# Altium project 025619-TurtleBot4 UI board.PrjPcb (part 2 of 3)

## Sheet USB Downstream Type C Port 3.SchDoc: DO NOT FILL THIS IN
size Tabloid; Date: DO NOT FILL THIS IN; ApprovedBy: DO NOT FILL THIS IN; CheckedBy: DO NOT FILL THIS IN; Author: DO NOT FILL THIS IN; CompanyName: DO NOT FILL THIS IN; DrawnBy: DO NOT FILL THIS IN; Engineer: DO NOT FILL THIS IN; Organization: DO NOT FILL THIS IN; Address1: DO NOT FILL THIS IN; Address2: DO NOT FILL THIS IN; Address3: DO NOT FILL THIS IN; Address4: DO NOT FILL THIS IN; DocumentNumber: DO NOT FILL THIS IN; Revision: DO NOT FILL THIS IN; SheetNumber: 7; SheetTotal: 9; PageSetup: Record=PageOptions|CenterHorizontal=True|CenterVertical=True|PrintScale=1.00|XCorrection=1.00|YCorrection=1.00|PrintKind=1|BorderSize=5000000|LeftOffset=0|BottomOffset=0|Orientation=2|PaperLength=1000|PaperWidth=1000|Scale=100|PaperSource=7|PrintQuality=-4|MediaType=1|DitherType=10|PaperKind=Ledger|PrintScaleMode=1; cpr-ItemNumber: 025619; cpr-ItemName1: TurtleBot4 UI board; cpr-ItemName2: Rev 2; cpr-Revision: 2; cpr-SheetNumber: 7; cpr-SheetTotal: 9; cpr-Draft: AG; cpr-DraftDate: 19/04/2022; Time: DO NOT FILL THIS IN; ImagePath: DO NOT FILL THIS IN; Application_BuildNumber: DO NOT FILL THIS IN
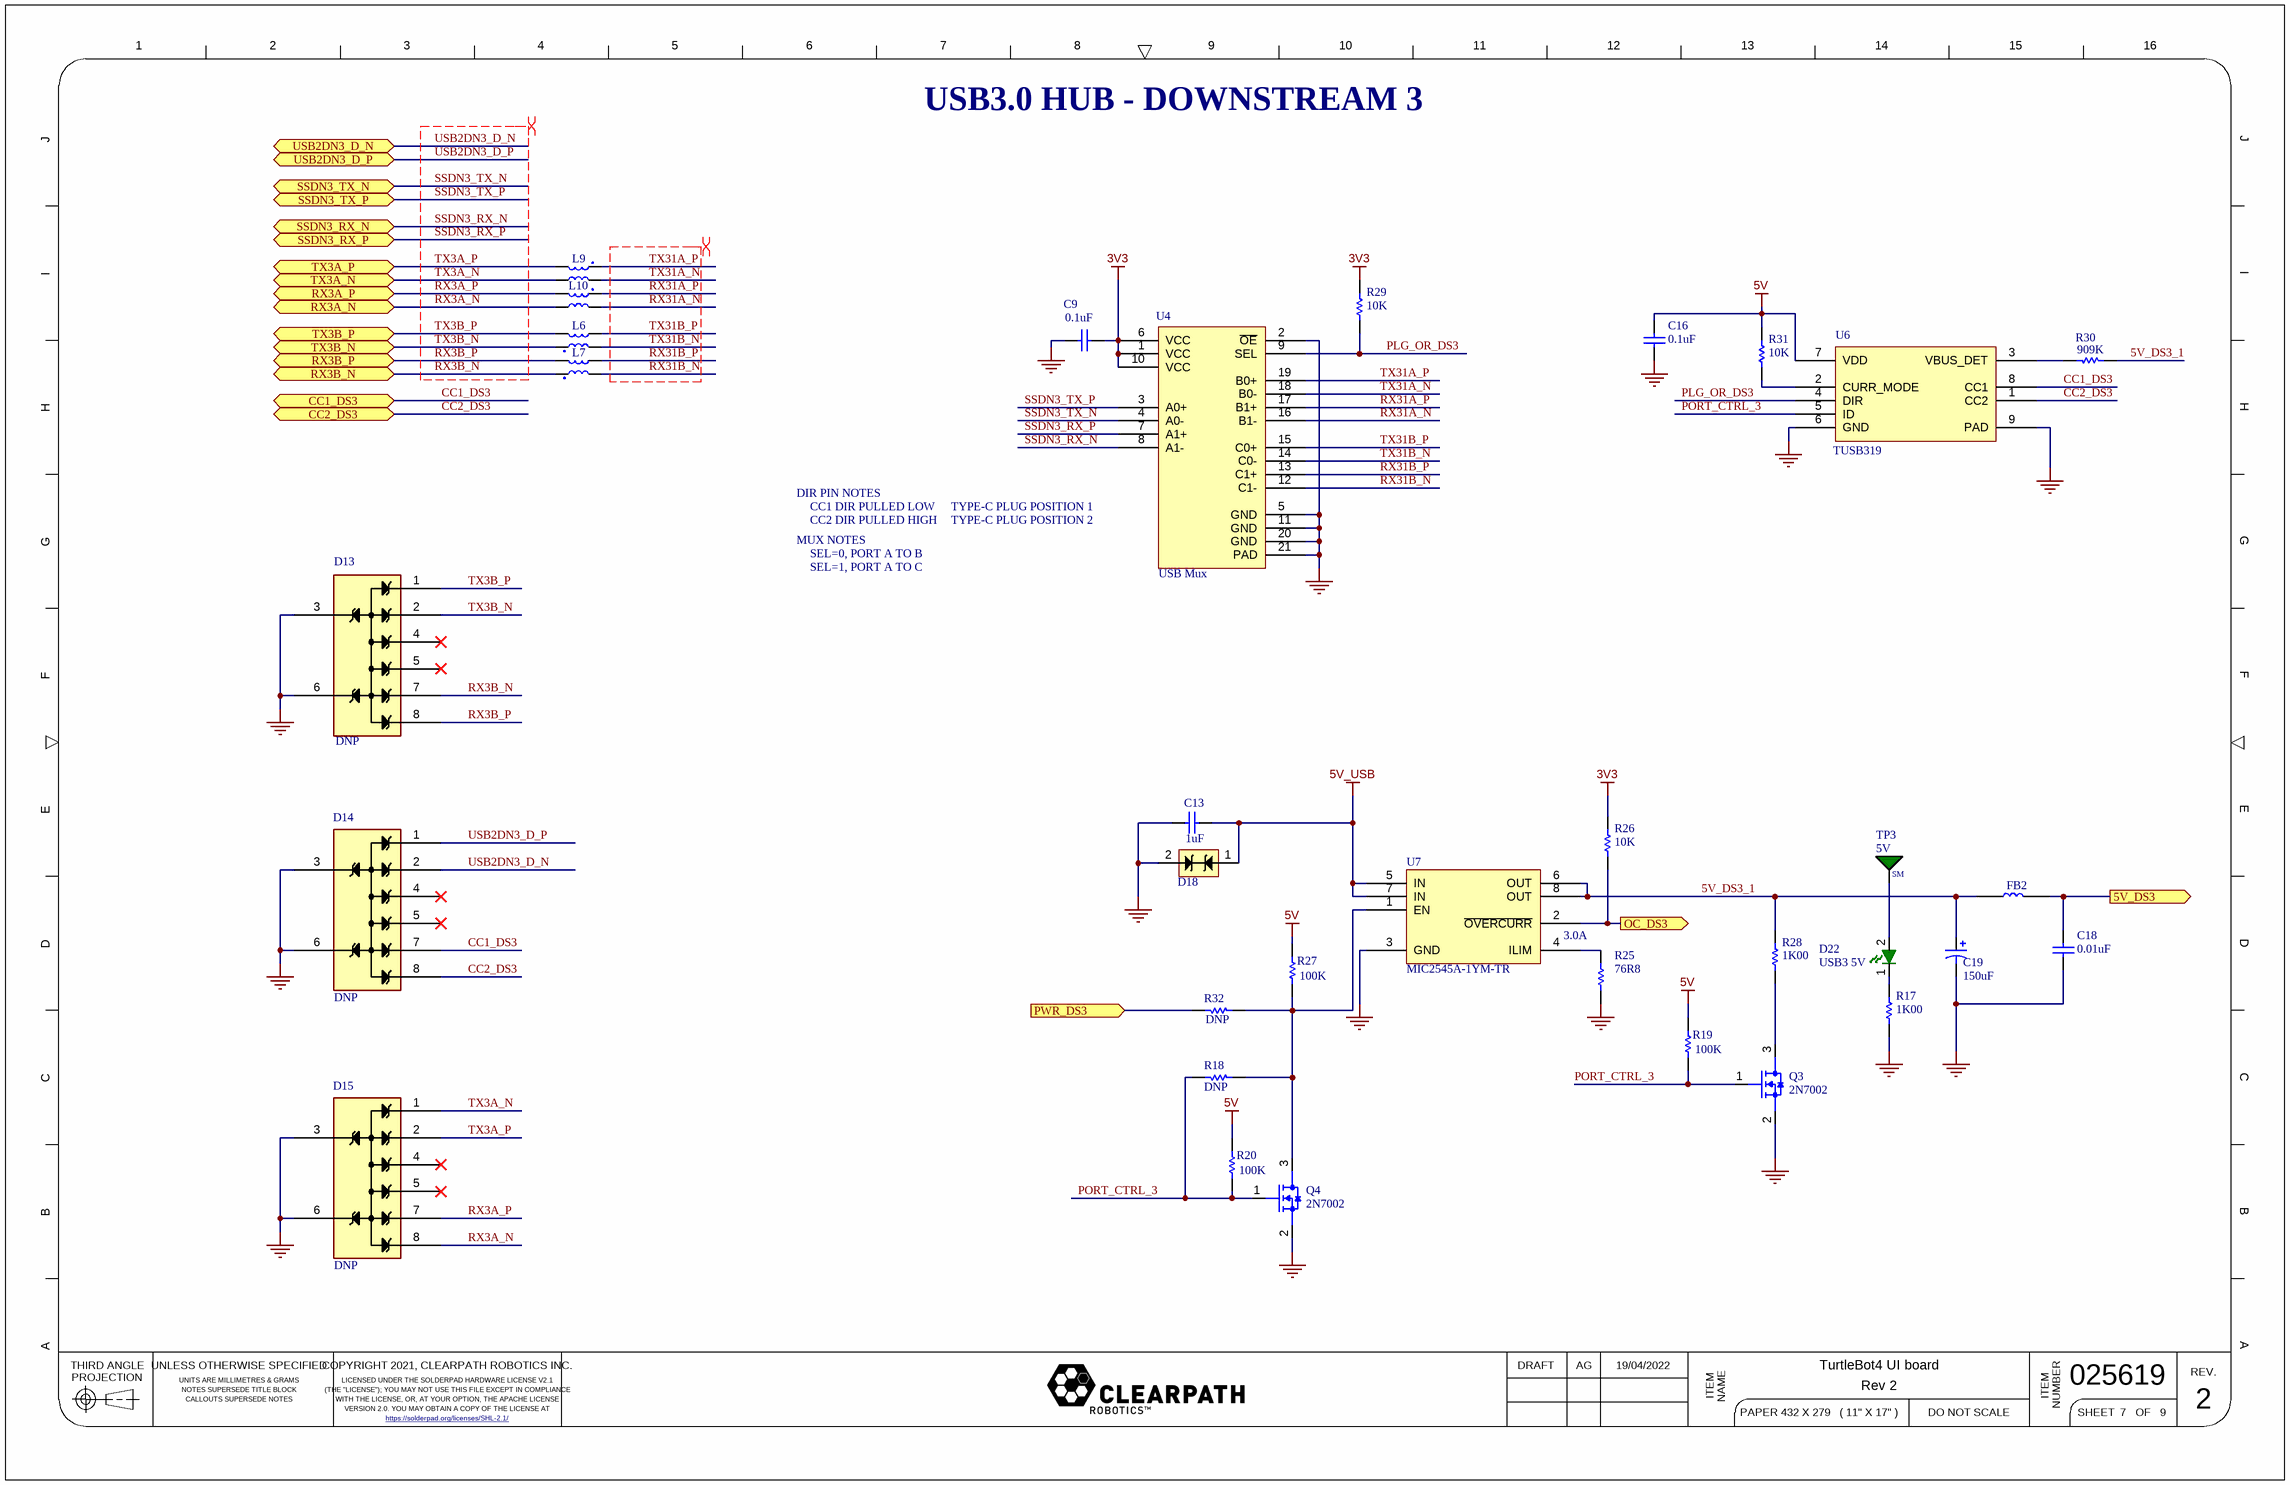
[diagram p4: USB Downstream Type C Port 3.SchDoc]

### Parts
C9  value 0.1uF  [C0805]  (hidden comment: Capacitor _SMT)
C13  value 1uF  [C0805]  (hidden comment: Capacitor _SMT)
C16  value 0.1uF  [C0805]  (hidden comment: Capacitor _SMT)
C18  value 0.01uF  [C0805]  (hidden comment: Capacitor _SMT)
C19  value 150uF  [CAPMP7.6X4.3_3.1N_KEM-M]  (hidden comment: Cap Tant)
D13  DNP  [ESD7016]
D14  DNP  [ESD7016]
D15  DNP  [ESD7016]
D18  TVS DIODE BIDIR 15V SMC  [DO-214AA]  (value not drawn)
D22  USB3 5V  [LED_0805_GRN]
FB2  742792602  [R0603]  (value not drawn)
L6  CMC 100MA 2LN 90 OHM SMD2  [cmc_90_ohms]  (value not drawn)
L7  CMC 100MA 2LN 90 OHM SMD2  [cmc_90_ohms]  (value not drawn)
L9  CMC 100MA 2LN 90 OHM SMD2  [cmc_90_ohms]  (value not drawn)
L10  CMC 100MA 2LN 90 OHM SMD2  [cmc_90_ohms]  (value not drawn)
Q3  Mfg PN: 2N7002  [SOT-23-3]  (hidden comment: NFET)
Q4  Mfg PN: 2N7002  [SOT-23-3]  (hidden comment: NFET)
R17  value 1K00  [R0805]  (hidden comment: Resistor_SMT)
R18  value DNP  [R0805]  (hidden comment: Resistor_SMT)
R19  value 100K  [R0805]  (hidden comment: Resistor_SMT)
R20  value 100K  [R0805]  (hidden comment: Resistor_SMT)
R25  3.0A  value 76R8  [R0805]
R26  value 10K  [R0805]  (hidden comment: Resistor_SMT)
R27  value 100K  [R0805]  (hidden comment: Resistor_SMT)
R28  value 1K00  [R0805]  (hidden comment: Resistor_SMT)
R29  value 10K  [R0805]  (hidden comment: Resistor_SMT)
R30  value 909K  [R0805]  (hidden comment: Resistor_SMT)
R31  value 10K  [R0805]  (hidden comment: Resistor_SMT)
R32  value DNP  [R0805]  (hidden comment: Resistor_SMT)
TP3  5V  [TP_28SM]
U4  USB Mux  [TQFN20]
U6  TUSB319  [WSON8]
U7  Mfg PN: MIC2545A-1YM-TR  [SOIC-8-150]  (hidden comment: MIC2545_USB_SWITCH)

### Ports
5V_DS3 (out), CC1_DS3 (bidir), CC2_DS3 (bidir), OC_DS3 (out), PWR_DS3 (in), RX3A_N (bidir), RX3A_P (bidir), RX3B_N (bidir), RX3B_P (bidir), SSDN3_RX_N (bidir), SSDN3_RX_P (bidir), SSDN3_TX_N (bidir), SSDN3_TX_P (bidir), TX3A_N (bidir), TX3A_P (bidir), TX3B_N (bidir), TX3B_P (bidir), USB2DN3_D_N (bidir), USB2DN3_D_P (bidir)

### Nets
3V3: C9.1 R26.1 R29.1 U4.1(VCC) U4.6(VCC) U4.10(VCC)
5V: C16.1 R19.2 R20.2 R27.2 R31.1 U6.7(VDD)
5V_USB: C13.2 D18.1 U7.5(IN) U7.7(IN)
GND: C9.2 C13.1 C16.2 C18.2 C19.2 D13.3 D13.6 D14.3 D14.6 D15.3 D15.6 D18.2 Q3.2(D1) Q4.2(D1) R17.2 R25.1 U4.2(~{OE}) U4.5(GND) U4.11(GND) U4.20(GND) U4.21(PAD) U6.6(GND) U6.9(PAD) U7.3(GND)
5V_DS3: C18.1 FB2.2 ; port 5V_DS3
5V_DS3_1: C19.1 FB2.1 R28.1 R30.2 U7.6(OUT) U7.8(OUT)
CC1_DS3: D14.7 U6.8(CC1) ; port CC1_DS3
CC2_DS3: D14.8 U6.1(CC2) ; port CC2_DS3
OC_DS3: R26.2 U7.2(~{OVERCURR}) ; port OC_DS3
PLG_OR_DS3: R29.2 U4.9(SEL) U6.4(DIR)
PORT_CTRL_3: Q3.1(G1) Q4.1(G1) R18.1 R19.1 R20.1 U6.5(ID)
PWR_DS3: R32.1 ; port PWR_DS3
RX3A_N: D15.8 L10.3 ; port RX3A_N
RX3A_P: D15.7 L10.4 ; port RX3A_P
RX3B_N: D13.7 L7.1 ; port RX3B_N
RX3B_P: D13.8 L7.2 ; port RX3B_P
RX31A_N: L10.2 U4.16(B1-)
RX31A_P: L10.1 U4.17(B1+)
RX31B_N: L7.4 U4.12(C1-)
RX31B_P: L7.3 U4.13(C1+)
SSDN3_RX_N: U4.8(A1-) ; port SSDN3_RX_N
SSDN3_RX_P: U4.7(A1+) ; port SSDN3_RX_P
SSDN3_TX_N: U4.4(A0-) ; port SSDN3_TX_N
SSDN3_TX_P: U4.3(A0+) ; port SSDN3_TX_P
TX3A_N: D15.1 L9.3 ; port TX3A_N
TX3A_P: D15.2 L9.4 ; port TX3A_P
TX3B_N: D13.2 L6.1 ; port TX3B_N
TX3B_P: D13.1 L6.2 ; port TX3B_P
TX31A_N: L9.2 U4.18(B0-)
TX31A_P: L9.1 U4.19(B0+)
TX31B_N: L6.4 U4.14(C0-)
TX31B_P: L6.3 U4.15(C0+)
USB2DN3_D_N: D14.2 ; port USB2DN3_D_N
USB2DN3_D_P: D14.1 ; port USB2DN3_D_P
NetD22_1: D22.1(RK) R17.1
NetD22_2: D22.2(RA) TP3.1
NetQ3_3: Q3.3(S1) R28.2
NetQ4_3: Q4.3(S1) R18.2 R27.1 R32.2 U7.1(EN)
NetR25_2: R25.2 U7.4(ILIM)
NetR30_1: R30.1 U6.3(VBUS_DET)
NetR31_2: R31.2 U6.2(CURR_MODE)

Not connected (* = marked no-connect by the designer): D13 4* 5*; D14 4* 5*; D15 4* 5*

### Layout directives
differential pair; net class USB3; differential pair class DIFF90; rule Matched Net Lengths [Tolerance = 15mil]: RX3A_N, RX3A_P, RX3B_N, RX3B_P, RX31A_N, RX31A_P, RX31B_N, RX31B_P, SSDN3_RX_N, SSDN3_RX_P, SSDN3_TX_N, SSDN3_TX_P, TX3A_N, TX3A_P, TX3B_N, TX3B_P, TX31A_N, TX31A_P, TX31B_N, TX31B_P, USB2DN3_D_N, USB2DN3_D_P

### Notes on the sheet
- USB3.0 HUB - DOWNSTREAM 3
- DIR PIN NOTES
- MUX NOTES
- CC1 DIR PULLED LOW
- CC2 DIR PULLED HIGH
- SEL=0, PORT A TO B
- SEL=1, PORT A TO C
- TYPE-C PLUG POSITION 1
- TYPE-C PLUG POSITION 2
- 1
- 2
- 3
- 4
- 5
- 6
- 7
- 8
- 9
- 10
- 11
- 12
- 13
- 14
- 15
- 16
- J
- I
- H
- G
- F
- E
- D
- C
- B
- A
- THIRD ANGLE
- PROJECTION
- UNLESS OTHERWISE SPECIFIED
- COPYRIGHT 2021, CLEARPATH ROBOTICS INC.
- DRAFT
- REV.
- UNITS ARE MILLIMETRES & GRAMS
- NOTES SUPERSEDE TITLE BLOCK
- CALLOUTS SUPERSEDE NOTES
- LICENSED UNDER THE SOLDERPAD HARDWARE LICENSE V2.1
- (THE "LICENSE"); YOU MAY NOT USE THIS FILE EXCEPT IN COMPLIANCE
- WITH THE LICENSE, OR, AT YOUR OPTION, THE APACHE LICENSE
- VERSION 2.0. YOU MAY OBTAIN A COPY OF THE LICENSE AT
- https://solderpad.org/licenses/SHL-2.1/ <https://solderpad.https://solderpad.org/licenses/SHL-2.1/org/licenses/SHL-2.1/>
- ITEM
- NAME
- PAPER 432 X 279   ( 11" X 17" )
- DO NOT SCALE
- NUMBER
- SHEET
- OF
- (in symbol TP_28SM) SM

### Library data of the parts
C9 C16 = Capacitor _SMT: as C1 on sheet Top Level; DNP: *; Package: 0805
C13 = Capacitor _SMT: as C7 on sheet USB Downstream Type C Port 4; DNP: *; Package: 0805
C18 = Capacitor _SMT: as C8 on sheet USB Downstream Type C Port 4; DNP: *; Package: 0603; Supplier 1: Digi-Key; Supplier Part Number 1: 1276-CL10B103KB8WPNDCT-ND
C19 = Cap Pol1: as C4 on sheet USB Downstream Type C Port 4; Voltage: 16V; Tolerance: 10%; Package: 2917; Supplier 1: Digi-Key; Supplier Part Number 1: 718-1746-1-ND
D13-D15 = ESD7016: as D16 on sheet USB Distribution; Vendor 2 PN: *; Vendor 2: *
D18 = TVS DIODE BIDIR 15V SMC: as D20 on sheet User Interface; Package: DO214AC; Supplier 1: Digi-Key; Supplier Part Number 1: 18-SMA6J5.0CACT-ND
D22 = GREEN_LED: as D12 on sheet USB Downstream Type C Port 4; Package: 0805
FB2 = 742792602: as FB1 on sheet USB Downstream Type C Port 4; Supplier 1: Digi-Key; Supplier Part Number 1: 732-4660-1-ND
L6 L7 L9 L10 = CMC 90_Ohms: as L3 on sheet USB Distribution; Supplier 1: Digi-Key; Supplier Part Number 1: 490-16595-1-ND
Q3 Q4 = NFET_SNGL: as Q5 on sheet User Interface; Package: SOT23-3
R17 R28 = Resistor_SMT: as R23 on sheet User Interface; Power Rating: *; Package: 0805
R18 R32 = Resistor_SMT: as R3 on sheet USB Downstream Type C Port 4; Power Rating: *; Package: 0805
R19 R20 R27 = Resistor_SMT: as R2 on sheet USB Downstream Type C Port 4; Power Rating: *; Package: 0805
R25 = Resistor_SMT: as R7 on sheet USB Downstream Type C Port 4; Power Rating: *; Package: 0805
R26 R29 R31 = Resistor_SMT: as R21 on sheet User Interface; Power Rating: *; Package: 0805
  R26: Supplier 1: Digi-Key; Supplier Part Number 1: 311-10.0KCRTR-ND
R30 = Resistor_SMT: as R11 on sheet USB Downstream Type C Port 4; Power Rating: *; Package: 0805
TP3 = TP_28SM: as TP1 on sheet USB Downstream Type C Port 4; PCB Component: TP_28SM; Status: Draft; Vendor: Clearpath Robotics Inc.; Vendor PN: TP_28SM; Type: SM Pad; Features: Exposed 28mil pad; Octopart Link: N/A
U4 = TC7PCI3212: as U1 on sheet USB Downstream Type C Port 4; Package: TQFN-20; Mfg PN: TC7PCI3212MT,LF
U6 = TUSB319: as U3 on sheet USB Downstream Type C Port 4; Package: WSON8
U7 = MIC2545_USB_SWITCH: IC PWR SWITCH N-CHAN 1:1 8SOIC; Manufacturer: Microchip; Vendor PN: MIC2545A-1YM-CT-ND; Vendor: Digikey; Package: SOIC8

## Sheet USB Downstream Type C Port 2.SchDoc: DO NOT FILL THIS IN
size Tabloid; Date: DO NOT FILL THIS IN; ApprovedBy: DO NOT FILL THIS IN; CheckedBy: DO NOT FILL THIS IN; Author: DO NOT FILL THIS IN; CompanyName: DO NOT FILL THIS IN; DrawnBy: DO NOT FILL THIS IN; Engineer: DO NOT FILL THIS IN; Organization: DO NOT FILL THIS IN; Address1: DO NOT FILL THIS IN; Address2: DO NOT FILL THIS IN; Address3: DO NOT FILL THIS IN; Address4: DO NOT FILL THIS IN; DocumentNumber: DO NOT FILL THIS IN; Revision: DO NOT FILL THIS IN; SheetNumber: 6; SheetTotal: 9; PageSetup: Record=PageOptions|CenterHorizontal=True|CenterVertical=True|PrintScale=1.00|XCorrection=1.00|YCorrection=1.00|PrintKind=1|BorderSize=5000000|LeftOffset=0|BottomOffset=0|Orientation=2|PaperLength=1000|PaperWidth=1000|Scale=100|PaperSource=7|PrintQuality=-4|MediaType=1|DitherType=10|PaperKind=Ledger|PrintScaleMode=1; cpr-ItemNumber: 025619; cpr-ItemName1: TurtleBot4 UI board; cpr-ItemName2: Rev 2; cpr-Revision: 2; cpr-SheetNumber: 6; cpr-SheetTotal: 9; cpr-Draft: AG; cpr-DraftDate: 19/04/2022; Time: DO NOT FILL THIS IN; ImagePath: DO NOT FILL THIS IN; Application_BuildNumber: DO NOT FILL THIS IN
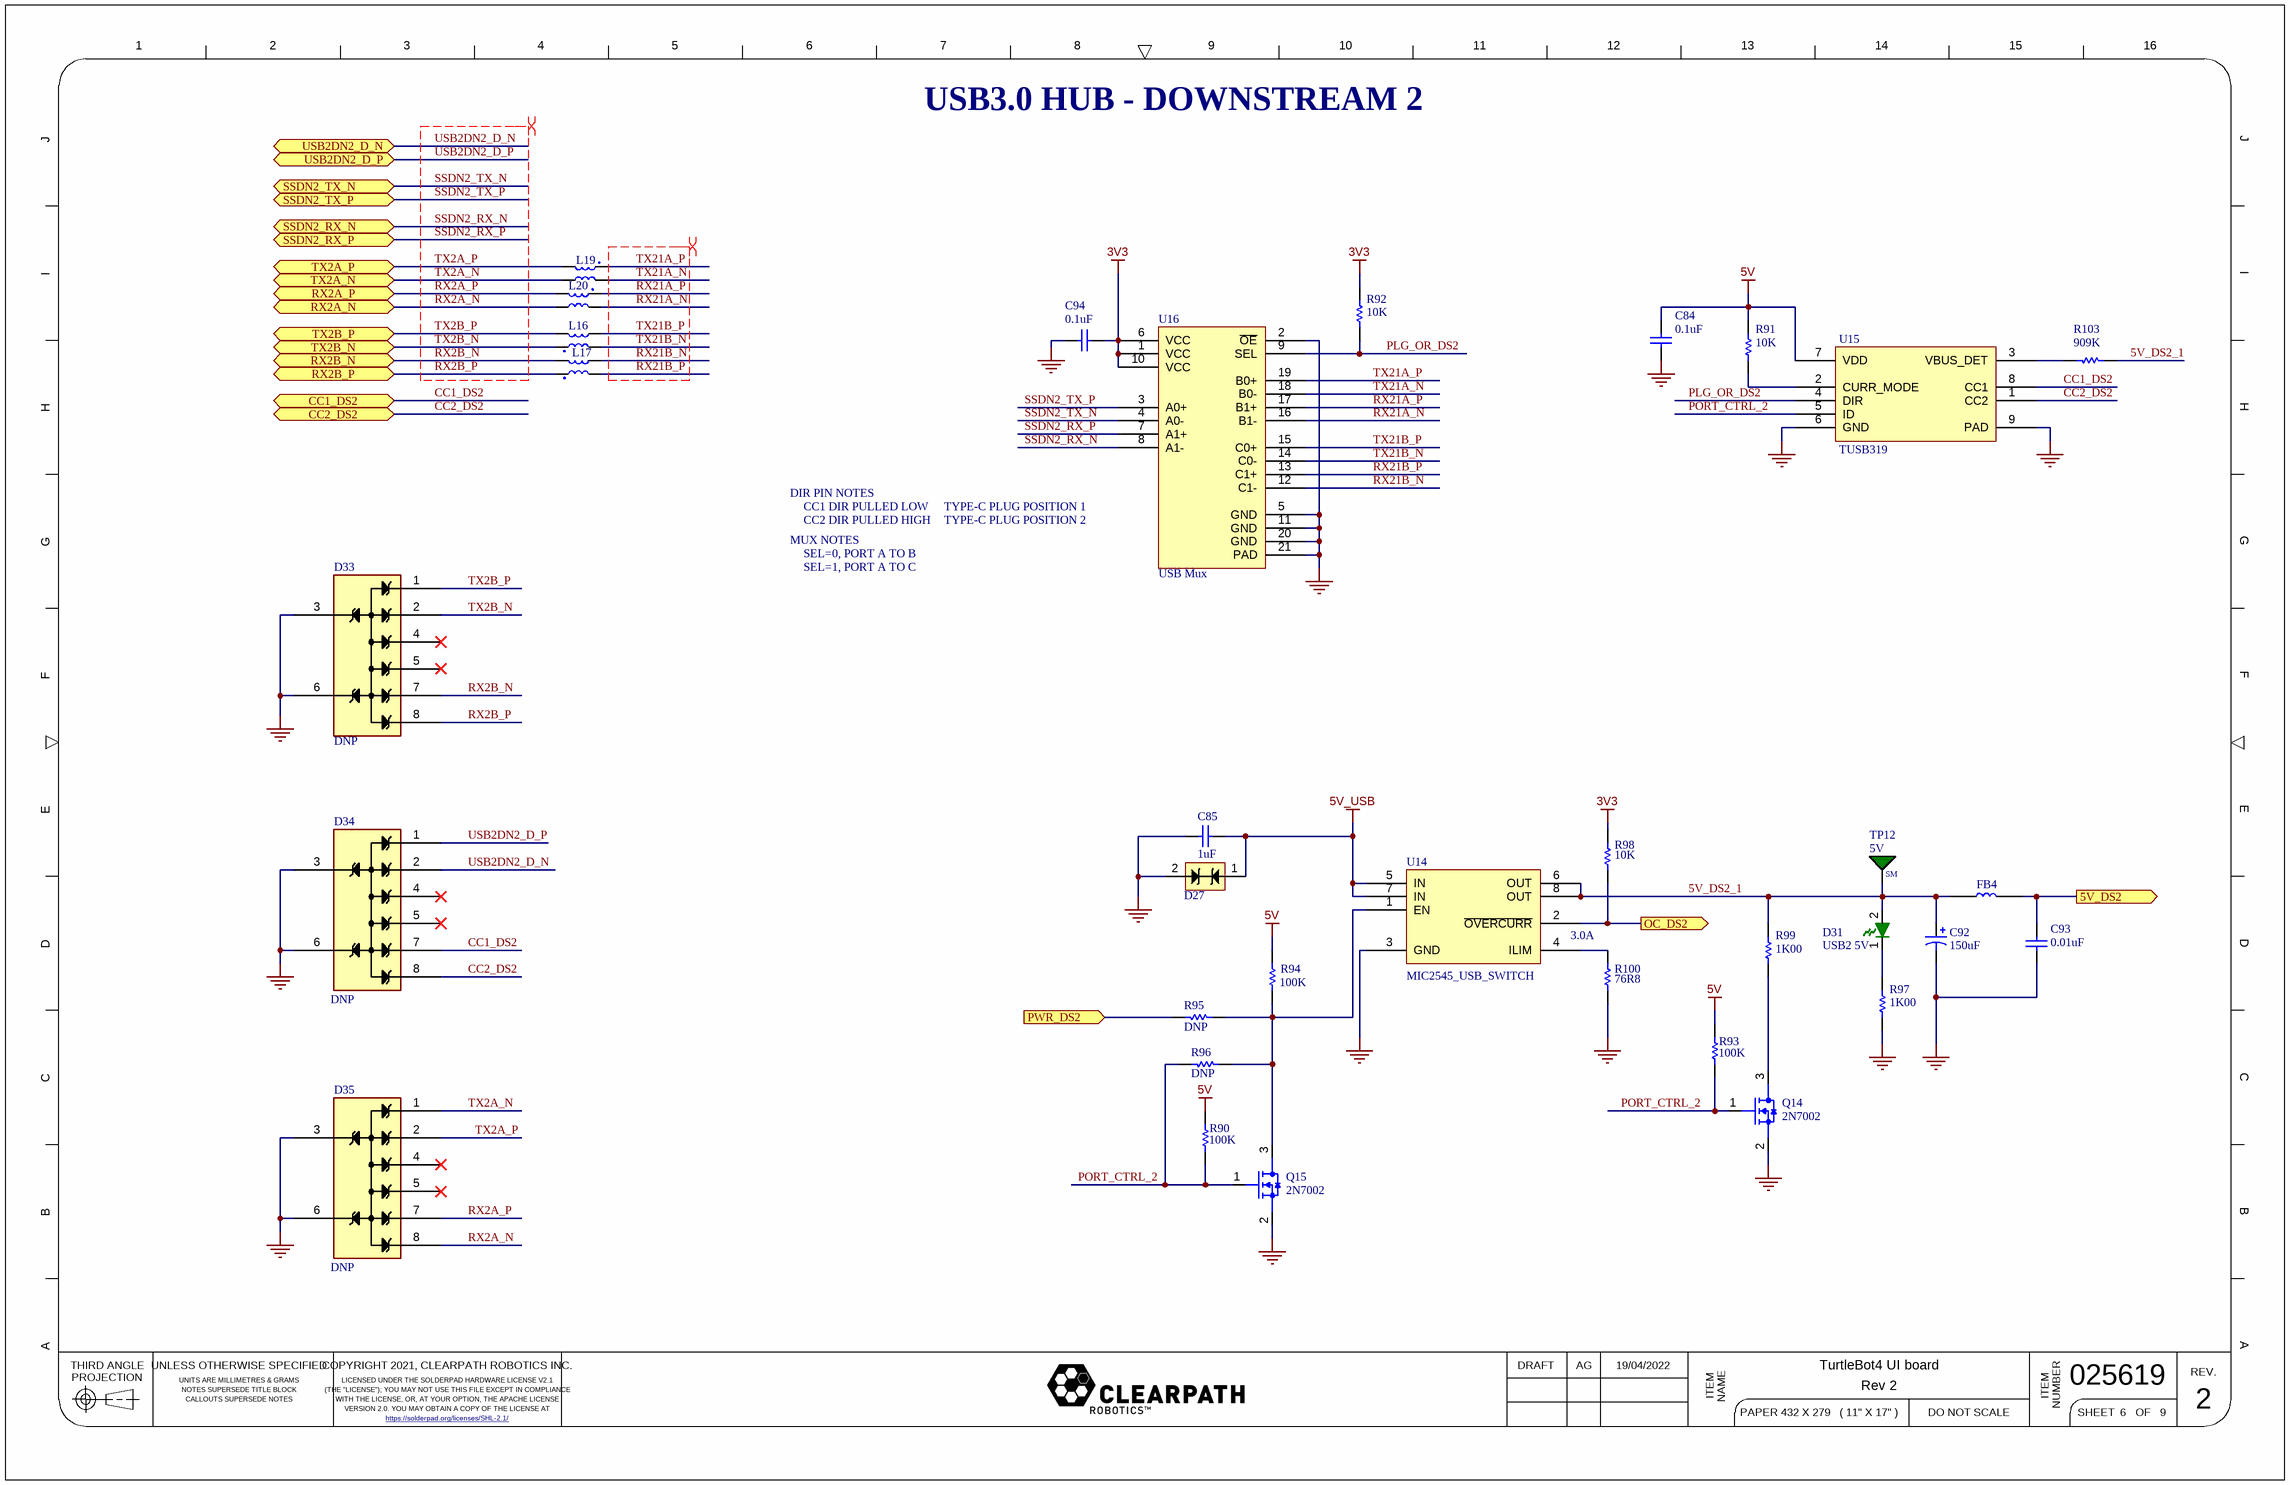
[diagram p5: USB Downstream Type C Port 2.SchDoc]

### Parts
C84  value 0.1uF  [C0805]  (hidden comment: Capacitor _SMT)
C85  value 1uF  [C0805]  (hidden comment: Capacitor _SMT)
C92  value 150uF  [CAPMP7.6X4.3_3.1N_KEM-M]  (hidden comment: Cap Tant)
C93  value 0.01uF  [C0805]  (hidden comment: Capacitor _SMT)
C94  value 0.1uF  [C0805]  (hidden comment: Capacitor _SMT)
D27  TVS DIODE BIDIR 15V SMC  [DO-214AA]  (value not drawn)
D31  USB2 5V  [LED_0805_GRN]
D33  DNP  [ESD7016]
D34  DNP  [ESD7016]
D35  DNP  [ESD7016]
FB4  742792602  [R0603]  (value not drawn)
L16  CMC 100MA 2LN 90 OHM SMD2  [cmc_90_ohms]  (value not drawn)
L17  CMC 100MA 2LN 90 OHM SMD2  [cmc_90_ohms]  (value not drawn)
L19  CMC 100MA 2LN 90 OHM SMD2  [cmc_90_ohms]  (value not drawn)
L20  CMC 100MA 2LN 90 OHM SMD2  [cmc_90_ohms]  (value not drawn)
Q14  Mfg PN: 2N7002  [SOT-23-3]  (hidden comment: NFET)
Q15  Mfg PN: 2N7002  [SOT-23-3]  (hidden comment: NFET)
R90  value 100K  [R0805]  (hidden comment: Resistor_SMT)
R91  value 10K  [R0805]  (hidden comment: Resistor_SMT)
R92  value 10K  [R0805]  (hidden comment: Resistor_SMT)
R93  value 100K  [R0805]  (hidden comment: Resistor_SMT)
R94  value 100K  [R0805]  (hidden comment: Resistor_SMT)
R95  value DNP  [R0805]  (hidden comment: Resistor_SMT)
R96  value DNP  [R0805]  (hidden comment: Resistor_SMT)
R97  value 1K00  [R0805]  (hidden comment: Resistor_SMT)
R98  value 10K  [R0805]  (hidden comment: Resistor_SMT)
R99  value 1K00  [R0805]  (hidden comment: Resistor_SMT)
R100  3.0A  value 76R8  [R0805]
R103  value 909K  [R0805]  (hidden comment: Resistor_SMT)
TP12  5V  [TP_28SM]
U14  MIC2545_USB_SWITCH  [SOIC-8-150]
U15  TUSB319  [WSON8]
U16  USB Mux  [TQFN20]

### Ports
5V_DS2 (out), CC1_DS2 (bidir), CC2_DS2 (bidir), OC_DS2 (out), PWR_DS2 (in), RX2A_N (bidir), RX2A_P (bidir), RX2B_N (bidir), RX2B_P (bidir), SSDN2_RX_N (bidir), SSDN2_RX_P (bidir), SSDN2_TX_N (bidir), SSDN2_TX_P (bidir), TX2A_N (bidir), TX2A_P (bidir), TX2B_N (bidir), TX2B_P (bidir), USB2DN2_D_N (bidir), USB2DN2_D_P (bidir)

### Nets
3V3: C94.1 R92.1 R98.1 U16.1(VCC) U16.6(VCC) U16.10(VCC)
5V: C84.1 R90.2 R91.1 R93.2 R94.2 U15.7(VDD)
5V_USB: C85.2 D27.1 U14.5(IN) U14.7(IN)
GND: C84.2 C85.1 C92.2 C93.2 C94.2 D27.2 D33.3 D33.6 D34.3 D34.6 D35.3 D35.6 Q14.2(D1) Q15.2(D1) R97.2 R100.1 U14.3(GND) U15.6(GND) U15.9(PAD) U16.2(~{OE}) U16.5(GND) U16.11(GND) U16.20(GND) U16.21(PAD)
5V_DS2: C93.1 FB4.2 ; port 5V_DS2
5V_DS2_1: C92.1 D31.2(RA) FB4.1 R99.1 R103.2 TP12.1 U14.6(OUT) U14.8(OUT)
CC1_DS2: D34.7 U15.8(CC1) ; port CC1_DS2
CC2_DS2: D34.8 U15.1(CC2) ; port CC2_DS2
OC_DS2: R98.2 U14.2(~{OVERCURR}) ; port OC_DS2
PLG_OR_DS2: R92.2 U15.4(DIR) U16.9(SEL)
PORT_CTRL_2: Q14.1(G1) Q15.1(G1) R90.1 R93.1 R96.1 U15.5(ID)
PWR_DS2: R95.1 ; port PWR_DS2
RX2A_N: D35.8 L20.3 ; port RX2A_N
RX2A_P: D35.7 L20.4 ; port RX2A_P
RX2B_N: D33.7 L17.2 ; port RX2B_N
RX2B_P: D33.8 L17.1 ; port RX2B_P
RX21A_N: L20.2 U16.16(B1-)
RX21A_P: L20.1 U16.17(B1+)
RX21B_N: L17.3 U16.12(C1-)
RX21B_P: L17.4 U16.13(C1+)
SSDN2_RX_N: U16.8(A1-) ; port SSDN2_RX_N
SSDN2_RX_P: U16.7(A1+) ; port SSDN2_RX_P
SSDN2_TX_N: U16.4(A0-) ; port SSDN2_TX_N
SSDN2_TX_P: U16.3(A0+) ; port SSDN2_TX_P
TX2A_N: D35.1 L19.3 ; port TX2A_N
TX2A_P: D35.2 L19.4 ; port TX2A_P
TX2B_N: D33.2 L16.1 ; port TX2B_N
TX2B_P: D33.1 L16.2 ; port TX2B_P
TX21A_N: L19.2 U16.18(B0-)
TX21A_P: L19.1 U16.19(B0+)
TX21B_N: L16.4 U16.14(C0-)
TX21B_P: L16.3 U16.15(C0+)
USB2DN2_D_N: D34.2 ; port USB2DN2_D_N
USB2DN2_D_P: D34.1 ; port USB2DN2_D_P
NetD31_1: D31.1(RK) R97.1
NetQ14_3: Q14.3(S1) R99.2
NetQ15_3: Q15.3(S1) R94.1 R95.2 R96.2 U14.1(EN)
NetR91_2: R91.2 U15.2(CURR_MODE)
NetR100_2: R100.2 U14.4(ILIM)
NetR103_1: R103.1 U15.3(VBUS_DET)

Not connected (* = marked no-connect by the designer): D33 4* 5*; D34 4* 5*; D35 4* 5*

### Layout directives
differential pair; net class USB3; differential pair class DIFF90; rule Matched Net Lengths [Tolerance = 15mil]: RX2A_N, RX2A_P, RX2B_N, RX2B_P, RX21A_N, RX21A_P, RX21B_N, RX21B_P, SSDN2_RX_N, SSDN2_RX_P, SSDN2_TX_N, SSDN2_TX_P, TX2A_N, TX2A_P, TX2B_N, TX2B_P, TX21A_N, TX21A_P, TX21B_N, TX21B_P, USB2DN2_D_N, USB2DN2_D_P

### Notes on the sheet
- USB3.0 HUB - DOWNSTREAM 2
- DIR PIN NOTES
- MUX NOTES
- CC1 DIR PULLED LOW
- CC2 DIR PULLED HIGH
- SEL=0, PORT A TO B
- SEL=1, PORT A TO C
- TYPE-C PLUG POSITION 1
- TYPE-C PLUG POSITION 2
- 1
- 2
- 3
- 4
- 5
- 6
- 7
- 8
- 9
- 10
- 11
- 12
- 13
- 14
- 15
- 16
- J
- I
- H
- G
- F
- E
- D
- C
- B
- A
- THIRD ANGLE
- PROJECTION
- UNLESS OTHERWISE SPECIFIED
- COPYRIGHT 2021, CLEARPATH ROBOTICS INC.
- DRAFT
- REV.
- UNITS ARE MILLIMETRES & GRAMS
- NOTES SUPERSEDE TITLE BLOCK
- CALLOUTS SUPERSEDE NOTES
- LICENSED UNDER THE SOLDERPAD HARDWARE LICENSE V2.1
- (THE "LICENSE"); YOU MAY NOT USE THIS FILE EXCEPT IN COMPLIANCE
- WITH THE LICENSE, OR, AT YOUR OPTION, THE APACHE LICENSE
- VERSION 2.0. YOU MAY OBTAIN A COPY OF THE LICENSE AT
- https://solderpad.org/licenses/SHL-2.1/ <https://solderpad.https://solderpad.org/licenses/SHL-2.1/org/licenses/SHL-2.1/>
- ITEM
- NAME
- PAPER 432 X 279   ( 11" X 17" )
- DO NOT SCALE
- NUMBER
- SHEET
- OF
- (in symbol TP_28SM) SM

### Library data of the parts
C84 C94 = Capacitor _SMT: Capacitor; Tolerance: 10%; Voltage: 50V; Vendor: Digikey; Vendor PN: 311-1140-1-ND; Mfg: Yageo; Mfg PN: CC0805KRX7R9BB104; DNP: *; Package: 0805
C85 = Capacitor _SMT: Capacitor; Tolerance: -20 +80; Voltage: 50V; Vendor: Digikey; Vendor PN: 311-1909-1-ND; Mfg: Yageo; Mfg PN: CC0805ZKY5V9BB105; DNP: *; Package: 0805
C92 = Cap Pol1: CAP TANT 150UF 10% 16V 2917; Vendor: Digikey; Mfg PN: 293D157X9016D2TE3; Vendor PN: 718-1746-1-ND; Mfg: Vishay Sprague; Voltage: 16V; Tolerance: 10%; Package: 2917; Supplier 1: Digi-Key; Supplier Part Number 1: 718-1746-1-ND
C93 = Capacitor _SMT: Capacitor; Tolerance: 10%; Voltage: 50V; Vendor: Digikey; Vendor PN: 1276-CL10B103KB8WPNDCT-ND; Mfg: Samsung Electro-Mechanics; Mfg PN: CL10B103KB8WPND; DNP: *; Package: 0603; Supplier 1: Digi-Key; Supplier Part Number 1: 1276-CL10B103KB8WPNDCT-ND
D27 = TVS DIODE BIDIR 15V SMC: TVS 600W 15V BI-DIR DO-214AA; Vendor: Digikey; Vendor PN: 18-SMA6J5.0CACT-ND; Mfg: Littelfuse Inc.; Mfg PN: SMA6J5.0CA; Package: DO214AC; Supplier 1: Digi-Key; Supplier Part Number 1: 18-SMA6J5.0CACT-ND
D31 = GREEN_LED: Green LED; Vendor: Digikey; Mfg PN: LTST-C170KGKT; Mfg: LiteOn; Vendor 1: 160-1414-1-ND; Package: 0805
D33-D35 = ESD7016: USB3 TVS diode assy; Vendor 1: Digikey; Vendor 1 PN: ESD7016MUTAGOSCT-ND; Mfg: ON Semi; Mfg PN: ESD7016MUTAG; Vendor 2 PN: *; Vendor 2: *
FB4 = 742792602: 60 Ohms 1 Signal Line Ferrite Bead 0603 (1608 Metric) 3A 40mOhm; Supplier 1: Digi-Key; Supplier Part Number 1: 732-4660-1-ND
L16 L17 L19 L20 = CMC 90_Ohms: Line Common Mode Choke Surface Mount 90 Ohms 100mA DCR 5Ohm; Supplier 1: Digi-Key; Supplier Part Number 1: 490-16595-1-ND
Q14 Q15 = NFET_SNGL: Vendor: Digikey; Vendor PN: 2N7002NCT-ND; Mfg: ON Semi; Package: SOT23-3
R90 R93 R94 = Resistor_SMT: Resistor; Vendor: Digikey; Vendor PN: 311-100KCRCT-ND; Tolerance: 1%; Mfg: Yageo; Mfg PN: RC0805FR-07100KL; Power Rating: *; Package: 0805
R91 R92 R98 = Resistor_SMT: Resistor; Vendor: Digikey; Vendor PN: 311-10.0KCRCT-ND; Tolerance: 1%; Mfg: Yageo; Mfg PN: RC0805FR-0710KL; Power Rating: *; Package: 0805
  R98: Supplier 1: Digi-Key; Supplier Part Number 1: 311-10.0KCRTR-ND
R95 R96 = Resistor_SMT: Resistor; Vendor: Digikey; Vendor PN: 311-0.0ARCT-ND; Mfg: Yageo; Mfg PN: RC0805JR-070RL; Power Rating: *; Package: 0805
R97 R99 = Resistor_SMT: Resistor; Vendor: Digikey; Vendor PN: 311-1.00KCRCT-ND; Tolerance: 1%; Mfg: Yageo; Mfg PN: RC0805FR-071KL; Power Rating: *; Package: 0805
R100 = Resistor_SMT: Resistor; Vendor: Digikey; Vendor PN: 311-76.8CRCT-ND; Tolerance: 1%; Mfg: Yageo; Mfg PN: RC0805FR-0776R8L; Power Rating: *; Package: 0805
R103 = Resistor_SMT: Resistor; Vendor: Digikey; Vendor PN: 311-909KCRCT-ND; Tolerance: 1%; Mfg: Yageo; Mfg PN: RC0805FR-07909KL; Power Rating: *; Package: 0805
TP12 = TP_28SM: Test point, 28 Mil exposed pad; Manufacturer: Clearpath Robotics Inc.; ID: 1; PCB Component: TP_28SM; Status: Draft; Vendor: Clearpath Robotics Inc.; Vendor PN: TP_28SM; Type: SM Pad; Features: Exposed 28mil pad; Octopart Link: N/A
U14 = MIC2545_USB_SWITCH: IC PWR SWITCH N-CHAN 1:1 8SOIC; Vendor PN: MIC2545A-1YM-CT-ND; Vendor: Digikey; Mfg PN: MIC2545A-1YM-TR; Mfg: Microchip; Package: SOIC8
U15 = TUSB319: USB Type C Controller; Vendor 1 PN: 595-TUSB319IDRFRQ1; Vendor 1: Mouser; Mfg PN: TUSB319IDRFRQ1; Mfg: Texas Instruments; Package: WSON8
U16 = TC7PCI3212: TC7PCI3212MT,LF USB3.0 Mux; Manufacturer: Toshiba; Vendor 1 PN: 757-TC7PCI3212MTLF; Vendor 1: Mouser; Package: TQFN-20; Mfg PN: TC7PCI3212MT,LF

## Sheet USB Hub.SchDoc: DO NOT FILL THIS IN
size Tabloid; Date: DO NOT FILL THIS IN; ApprovedBy: DO NOT FILL THIS IN; CheckedBy: DO NOT FILL THIS IN; Author: DO NOT FILL THIS IN; CompanyName: DO NOT FILL THIS IN; DrawnBy: DO NOT FILL THIS IN; Engineer: DO NOT FILL THIS IN; Organization: DO NOT FILL THIS IN; Address1: DO NOT FILL THIS IN; Address2: DO NOT FILL THIS IN; Address3: DO NOT FILL THIS IN; Address4: DO NOT FILL THIS IN; DocumentNumber: DO NOT FILL THIS IN; Revision: DO NOT FILL THIS IN; SheetNumber: 9; SheetTotal: 9; PageSetup: Record=PageOptions|CenterHorizontal=True|CenterVertical=True|PrintScale=1.00|XCorrection=1.00|YCorrection=1.00|PrintKind=1|BorderSize=5000000|LeftOffset=0|BottomOffset=0|Orientation=2|PaperLength=1000|PaperWidth=1000|Scale=100|PaperSource=7|PrintQuality=-4|MediaType=1|DitherType=10|PaperKind=Ledger|PrintScaleMode=1; cpr-ItemNumber: 025619; cpr-ItemName1: TurtleBot4 UI board; cpr-ItemName2: Rev 2; cpr-Revision: 2; cpr-SheetNumber: 9; cpr-SheetTotal: 9; cpr-Draft: AG; cpr-DraftDate: 19/04/2022; Time: DO NOT FILL THIS IN; ImagePath: DO NOT FILL THIS IN; Application_BuildNumber: DO NOT FILL THIS IN
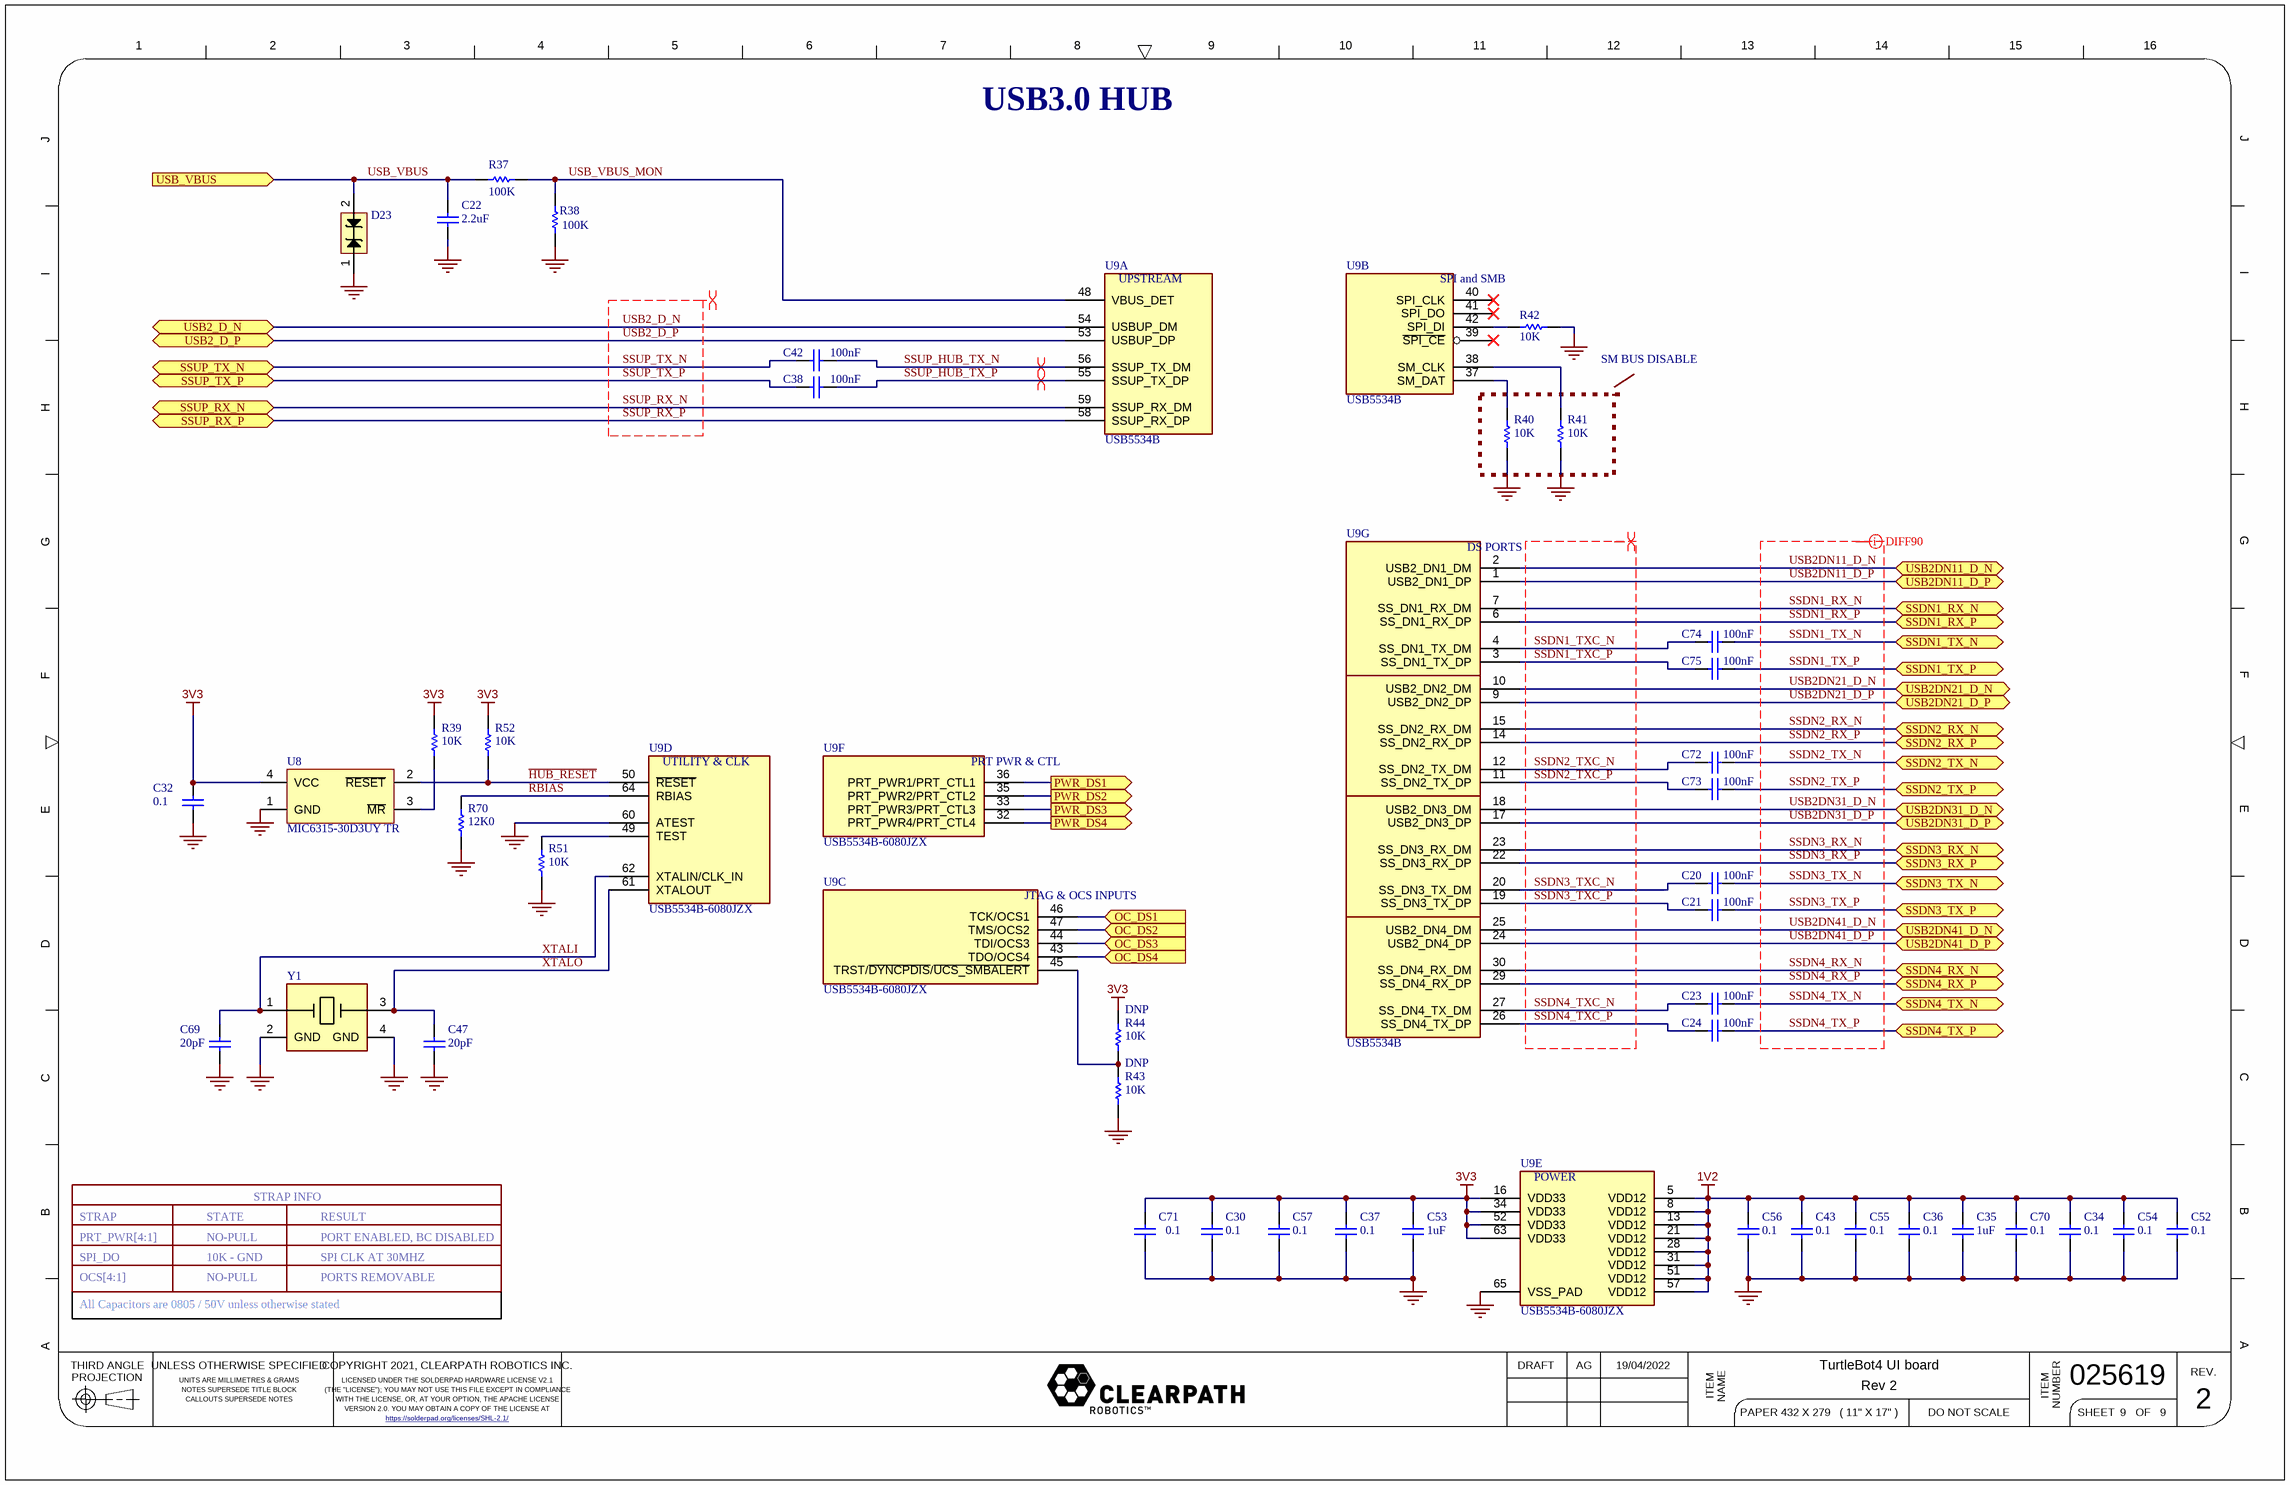
[diagram p6: USB Hub.SchDoc]

### Parts
C20  value 100nF  [CAP 1608[0603]]  (hidden comment: Capacitor _SMT)
C21  value 100nF  [CAP 1608[0603]]  (hidden comment: Capacitor _SMT)
C22  value 2.2uF  [C0805]  (hidden comment: Capacitor _SMT)
C23  value 100nF  [CAP 1608[0603]]  (hidden comment: Capacitor _SMT)
C24  value 100nF  [CAP 1608[0603]]  (hidden comment: Capacitor _SMT)
C30  value 0.1  [C0805]  (hidden comment: Capacitor _SMT)
C32  value 0.1  [C0805]  (hidden comment: Capacitor _SMT)
C34  value 0.1  [C0805]  (hidden comment: Capacitor _SMT)
C35  value 1uF  [C0805]  (hidden comment: Capacitor _SMT)
C36  value 0.1  [C0805]  (hidden comment: Capacitor _SMT)
C37  value 0.1  [C0805]  (hidden comment: Capacitor _SMT)
C38  value 100nF  [CAP 1608[0603]]  (hidden comment: Capacitor _SMT)
C42  value 100nF  [CAP 1608[0603]]  (hidden comment: Capacitor _SMT)
C43  value 0.1  [C0805]  (hidden comment: Capacitor _SMT)
C47  value 20pF  [C0805]  (hidden comment: Capacitor _SMT)
C52  value 0.1  [C0805]  (hidden comment: Capacitor _SMT)
C53  value 1uF  [C0805]  (hidden comment: Capacitor _SMT)
C54  value 0.1  [C0805]  (hidden comment: Capacitor _SMT)
C55  value 0.1  [C0805]  (hidden comment: Capacitor _SMT)
C56  value 0.1  [C0805]  (hidden comment: Capacitor _SMT)
C57  value 0.1  [C0805]  (hidden comment: Capacitor _SMT)
C69  value 20pF  [C0805]  (hidden comment: Capacitor _SMT)
C70  value 0.1  [C0805]  (hidden comment: Capacitor _SMT)
C71  value 0.1  [C0805]  (hidden comment: Capacitor _SMT)
C72  value 100nF  [CAP 1608[0603]]  (hidden comment: Capacitor _SMT)
C73  value 100nF  [CAP 1608[0603]]  (hidden comment: Capacitor _SMT)
C74  value 100nF  [CAP 1608[0603]]  (hidden comment: Capacitor _SMT)
C75  value 100nF  [CAP 1608[0603]]  (hidden comment: Capacitor _SMT)
D23  TVS DIODE BIDIR 15V SMC  [DO-214AA]  (value not drawn)
R37  value 100K  [R0805]  (hidden comment: Resistor_SMT)
R38  value 100K  [R0805]  (hidden comment: Resistor_SMT)
R39  value 10K  [R0805]  (hidden comment: Resistor_SMT)
R40  value 10K  [R0805]  (hidden comment: Resistor_SMT)
R41  value 10K  [R0805]  (hidden comment: Resistor_SMT)
R42  value 10K  [R0805]  (hidden comment: Resistor_SMT)
R43  value 10K  [R0805]  (hidden comment: Resistor_SMT)
R44  value 10K  [R0805]  (hidden comment: Resistor_SMT)
R51  value 10K  [R0805]  (hidden comment: Resistor_SMT)
R52  value 10K  [R0805]  (hidden comment: Resistor_SMT)
R70  value 12K0  [R0805]  (hidden comment: Resistor_SMT)
U8  Mfg PN: MIC6315-30D3UY TR  [SOT143 CPR]  (hidden comment: MIC6315)
U9  USB5534B  [QFN64_9x9_EP]  (parts A,B,C,D,E,F,G of 7)
Y1  ECS-250 crystal  [ECX-53B]  (value not drawn)

### Ports
OC_DS1 (in), OC_DS2 (in), OC_DS3 (in), OC_DS4 (in), PWR_DS1 (out), PWR_DS2 (out), PWR_DS3 (out), PWR_DS4 (out), SSDN1_RX_N (bidir), SSDN1_RX_P (bidir), SSDN1_TX_N (bidir), SSDN1_TX_P (bidir), SSDN2_RX_N (bidir), SSDN2_RX_P (bidir), SSDN2_TX_N (bidir), SSDN2_TX_P (bidir), SSDN3_RX_N (bidir), SSDN3_RX_P (bidir), SSDN3_TX_N (bidir), SSDN3_TX_P (bidir), SSDN4_RX_N (bidir), SSDN4_RX_P (bidir), SSDN4_TX_N (bidir), SSDN4_TX_P (bidir), SSUP_RX_N (bidir), SSUP_RX_P (bidir), SSUP_TX_N (bidir), SSUP_TX_P (bidir), USB2_D_N (bidir), USB2_D_P (bidir), USB2DN11_D_N (bidir), USB2DN11_D_P (bidir), USB2DN21_D_N (bidir), USB2DN21_D_P (bidir), USB2DN31_D_N (bidir), USB2DN31_D_P (bidir), USB2DN41_D_N (bidir), USB2DN41_D_P (bidir), USB_VBUS (in)

### Nets
1V2: C34.2 C35.2 C36.2 C43.2 C52.2 C54.2 C55.2 C56.2 C70.2 U9.5(VDD12) U9.8(VDD12) U9.13(VDD12) U9.21(VDD12) U9.28(VDD12) U9.31(VDD12) U9.51(VDD12) U9.57(VDD12)
3V3: C30.2 C32.2 C37.2 C53.2 C57.2 C71.2 R39.1 R44.1 R52.1 U8.4(VCC) U9.16(VDD33) U9.34(VDD33) U9.52(VDD33) U9.63(VDD33)
GND: C22.1 C30.1 C32.1 C34.1 C35.1 C36.1 C37.1 C43.1 C47.2 C52.1 C53.1 C54.1 C55.1 C56.1 C57.1 C69.2 C70.1 C71.1 D23.1 R38.1 R40.2 R41.2 R42.2 R43.2 R51.2 R70.2 U8.1(GND) U9.60(ATEST) U9.65(VSS_PAD) Y1.2(GND) Y1.4(GND)
~{HUB_RESET}: R52.2 U8.2(~{RESET}) U9.50(~{RESET})
OC_DS1: U9.46(TCK/OCS1) ; port OC_DS1
OC_DS2: U9.47(TMS/OCS2) ; port OC_DS2
OC_DS3: U9.44(TDI/OCS3) ; port OC_DS3
OC_DS4: U9.43(TDO/OCS4) ; port OC_DS4
PWR_DS1: U9.36(PRT_PWR1/PRT_CTL1) ; port PWR_DS1
PWR_DS2: U9.35(PRT_PWR2/PRT_CTL2) ; port PWR_DS2
PWR_DS3: U9.33(PRT_PWR3/PRT_CTL3) ; port PWR_DS3
PWR_DS4: U9.32(PRT_PWR4/PRT_CTL4) ; port PWR_DS4
RBIAS: R70.1 U9.64(RBIAS)
SSDN1_RX_N: U9.7(SS_DN1_RX_DM) ; port SSDN1_RX_N
SSDN1_RX_P: U9.6(SS_DN1_RX_DP) ; port SSDN1_RX_P
SSDN1_TX_N: C74.2 ; port SSDN1_TX_N
SSDN1_TX_P: C75.2 ; port SSDN1_TX_P
SSDN1_TXC_N: C74.1 U9.4(SS_DN1_TX_DM)
SSDN1_TXC_P: C75.1 U9.3(SS_DN1_TX_DP)
SSDN2_RX_N: U9.15(SS_DN2_RX_DM) ; port SSDN2_RX_N
SSDN2_RX_P: U9.14(SS_DN2_RX_DP) ; port SSDN2_RX_P
SSDN2_TX_N: C72.2 ; port SSDN2_TX_N
SSDN2_TX_P: C73.2 ; port SSDN2_TX_P
SSDN2_TXC_N: C72.1 U9.12(SS_DN2_TX_DM)
SSDN2_TXC_P: C73.1 U9.11(SS_DN2_TX_DP)
SSDN3_RX_N: U9.23(SS_DN3_RX_DM) ; port SSDN3_RX_N
SSDN3_RX_P: U9.22(SS_DN3_RX_DP) ; port SSDN3_RX_P
SSDN3_TX_N: C20.2 ; port SSDN3_TX_N
SSDN3_TX_P: C21.2 ; port SSDN3_TX_P
SSDN3_TXC_N: C20.1 U9.20(SS_DN3_TX_DM)
SSDN3_TXC_P: C21.1 U9.19(SS_DN3_TX_DP)
SSDN4_RX_N: U9.30(SS_DN4_RX_DM) ; port SSDN4_RX_N
SSDN4_RX_P: U9.29(SS_DN4_RX_DP) ; port SSDN4_RX_P
SSDN4_TX_N: C23.2 ; port SSDN4_TX_N
SSDN4_TX_P: C24.2 ; port SSDN4_TX_P
SSDN4_TXC_N: C23.1 U9.27(SS_DN4_TX_DM)
SSDN4_TXC_P: C24.1 U9.26(SS_DN4_TX_DP)
SSUP_HUB_TX_N: C42.2 U9.56(SSUP_TX_DM)
SSUP_HUB_TX_P: C38.2 U9.55(SSUP_TX_DP)
SSUP_RX_N: U9.59(SSUP_RX_DM) ; port SSUP_RX_N
SSUP_RX_P: U9.58(SSUP_RX_DP) ; port SSUP_RX_P
SSUP_TX_N: C42.1 ; port SSUP_TX_N
SSUP_TX_P: C38.1 ; port SSUP_TX_P
USB2_D_N: U9.54(USBUP_DM) ; port USB2_D_N
USB2_D_P: U9.53(USBUP_DP) ; port USB2_D_P
USB2DN11_D_N: U9.2(USB2_DN1_DM) ; port USB2DN11_D_N
USB2DN11_D_P: U9.1(USB2_DN1_DP) ; port USB2DN11_D_P
USB2DN21_D_N: U9.10(USB2_DN2_DM) ; port USB2DN21_D_N
USB2DN21_D_P: U9.9(USB2_DN2_DP) ; port USB2DN21_D_P
USB2DN31_D_N: U9.18(USB2_DN3_DM) ; port USB2DN31_D_N
USB2DN31_D_P: U9.17(USB2_DN3_DP) ; port USB2DN31_D_P
USB2DN41_D_N: U9.25(USB2_DN4_DM) ; port USB2DN41_D_N
USB2DN41_D_P: U9.24(USB2_DN4_DP) ; port USB2DN41_D_P
USB_VBUS: C22.2 D23.2 R37.1 ; port USB_VBUS
USB_VBUS_MON: R37.2 R38.2 U9.48(VBUS_DET)
XTALI: C69.1 U9.62(XTALIN/CLK_IN) Y1.1
XTALO: C47.1 U9.61(XTALOUT) Y1.3
NetR39_2: R39.2 U8.3(~{MR})
NetR40_1: R40.1 U9.37(SM_DAT)
NetR41_1: R41.1 U9.38(SM_CLK)
NetR42_1: R42.1 U9.42(SPI_DI)
NetR43_1: R43.1 R44.2 U9.45(TRST/~{DYNCPDIS}/~{UCS_SMBALERT})
NetR51_1: R51.1 U9.49(TEST)

Not connected (* = marked no-connect by the designer): U9 39(~{SPI_CE})* 40(SPI_CLK)* 41(SPI_DO)*

### Layout directives
differential pair; net class USB3; differential pair class DIFF90; rule Matched Net Lengths [Tolerance = 15mil]: SSDN1_TXC_N, SSDN1_TXC_P, SSDN2_TXC_N, SSDN2_TXC_P, SSDN3_TXC_N, SSDN3_TXC_P, SSDN4_TXC_N, SSDN4_TXC_P, SSUP_HUB_TX_N, SSUP_HUB_TX_P, SSUP_RX_N, SSUP_RX_P, SSUP_TX_N, SSUP_TX_P, USB2_D_N, USB2_D_P
differential pair; differential pair class DIFF90; rule Matched Net Lengths [Tolerance = 15mil]: SSDN1_RX_N, SSDN1_RX_P, SSDN1_TX_N, SSDN1_TX_P, SSDN2_RX_N, SSDN2_RX_P, SSDN2_TX_N, SSDN2_TX_P, SSDN3_RX_N, SSDN3_RX_P, SSDN3_TX_N, SSDN3_TX_P, SSDN4_RX_N, SSDN4_RX_P, SSDN4_TX_N, SSDN4_TX_P, USB2DN11_D_N, USB2DN11_D_P, USB2DN21_D_N, USB2DN21_D_P, USB2DN31_D_N, USB2DN31_D_P, USB2DN41_D_N, USB2DN41_D_P

### Notes on the sheet
- USB3.0 HUB
- SM BUS DISABLE
- STRAP
- PRT_PWR[4:1]
- STATE
- NO-PULL
- STRAP INFO
- RESULT
- PORT ENABLED, BC DISABLED
- SPI_DO
- OCS[4:1]
- 10K - GND
- SPI CLK AT 30MHZ
- PORTS REMOVABLE
- All Capacitors are 0805 / 50V unless otherwise stated
- 1
- 2
- 3
- 4
- 5
- 6
- 7
- 8
- 9
- 10
- 11
- 12
- 13
- 14
- 15
- 16
- J
- I
- H
- G
- F
- E
- D
- C
- B
- A
- THIRD ANGLE
- PROJECTION
- UNLESS OTHERWISE SPECIFIED
- COPYRIGHT 2021, CLEARPATH ROBOTICS INC.
- DRAFT
- REV.
- UNITS ARE MILLIMETRES & GRAMS
- NOTES SUPERSEDE TITLE BLOCK
- CALLOUTS SUPERSEDE NOTES
- LICENSED UNDER THE SOLDERPAD HARDWARE LICENSE V2.1
- (THE "LICENSE"); YOU MAY NOT USE THIS FILE EXCEPT IN COMPLIANCE
- WITH THE LICENSE, OR, AT YOUR OPTION, THE APACHE LICENSE
- VERSION 2.0. YOU MAY OBTAIN A COPY OF THE LICENSE AT
- https://solderpad.org/licenses/SHL-2.1/ <https://solderpad.https://solderpad.org/licenses/SHL-2.1/org/licenses/SHL-2.1/>
- ITEM
- NAME
- PAPER 432 X 279   ( 11" X 17" )
- DO NOT SCALE
- NUMBER
- SHEET
- OF
- (in symbol USB5534B, part A) UPSTREAM
- (in symbol USB5534B, part B) SPI and SMB
- (in symbol USB5534B, part C) JTAG & OCS INPUTS
- (in symbol USB5534B, part D) UTILITY & CLK
- (in symbol USB5534B, part E) POWER
- (in symbol USB5534B, part F) PRT PWR & CTL
- (in symbol USB5534B, part G) DS PORTS

### Library data of the parts
C20 C21 C23 C24 C38 C42 C72-C75 = Capacitor _SMT: Capacitor; Mfg PN: CC0805KRX7R8BB224; Tolerance: 10%; Voltage: 25V; Vendor: Digikey; Vendor PN: 311-1432-1-ND; Mfg: Yageo; DNP: *; Package: 0805
  C42: Supplier 1: Digi-Key; Supplier Part Number 1: 720-1856-1-ND
C22 C35 C53 = Capacitor _SMT: as C85 on sheet USB Downstream Type C Port 2; DNP: *; Package: 0805
C30 C32 C34 C36 C37 C43 C52 C54-C57 C70 C71 = Capacitor _SMT: as C84 on sheet USB Downstream Type C Port 2; DNP: *; Package: 0805
C47 C69 = Capacitor _SMT: Capacitor; Tolerance: 10%; Voltage: 50V; Vendor: Digikey; Vendor PN: 13-CC0805KRNPO9BN100CT-ND; Mfg: Yageo; Mfg PN: CC0805KRNPO9BN100; DNP: *; Package: 0805
D23 = TVS DIODE BIDIR 15V SMC: as D27 on sheet USB Downstream Type C Port 2; Package: DO214AC; Supplier 1: Digi-Key; Supplier Part Number 1: 18-SMA6J5.0CACT-ND
R37 R38 = Resistor_SMT: as R90 on sheet USB Downstream Type C Port 2; Power Rating: *; Package: 0805
R39-R44 R51 R52 = Resistor_SMT: as R91 on sheet USB Downstream Type C Port 2; Power Rating: *; Package: 0805
  R43 R44: DNP: DNP
R70 = Resistor_SMT: Resistor; Vendor: Digikey; Tolerance: 1%; Mfg: Yageo; Mfg PN: RC0805FR-0712KL; Vendor 1: 311-12.0KCRCT-ND; Power Rating: *; Package: 0805
U8 = MIC6315: IC RESET GEN 3.00V VTH SOT143-4; Vendor: Digikey; Vendor PN: 576-2890-1-ND; Mfg: Micrel; Package: SOT143
U9 = USB5534B: USB5534B 4-port USB3 hub; Mfg: Microchip; Vendor 1: Digikey; Vendor 1 PN: USB5534B-6080JZX-ND; Vendor 2: Mouser; Vendor 2 PN: 579-USB5534B-6080JZX; Mfg PN: USB5534B-6080JZX; Package: QFN64
Y1 = ECS-250 crystal: Vendor PN: XC1124CT-ND; Mfg: ECS; Vendor: Digikey; Mfg PN: ECS-250-20-30B-TR; Frequency: 25MHz

## Sheet USB Downstream Type C Port 1.SchDoc: DO NOT FILL THIS IN
size Tabloid; Date: DO NOT FILL THIS IN; ApprovedBy: DO NOT FILL THIS IN; CheckedBy: DO NOT FILL THIS IN; Author: DO NOT FILL THIS IN; CompanyName: DO NOT FILL THIS IN; DrawnBy: DO NOT FILL THIS IN; Engineer: DO NOT FILL THIS IN; Organization: DO NOT FILL THIS IN; Address1: DO NOT FILL THIS IN; Address2: DO NOT FILL THIS IN; Address3: DO NOT FILL THIS IN; Address4: DO NOT FILL THIS IN; DocumentNumber: DO NOT FILL THIS IN; Revision: DO NOT FILL THIS IN; SheetNumber: 5; SheetTotal: 9; PageSetup: Record=PageOptions|CenterHorizontal=True|CenterVertical=True|PrintScale=1.00|XCorrection=1.00|YCorrection=1.00|PrintKind=1|BorderSize=5000000|LeftOffset=0|BottomOffset=0|Orientation=2|PaperLength=1000|PaperWidth=1000|Scale=100|PaperSource=7|PrintQuality=-4|MediaType=1|DitherType=10|PaperKind=Ledger|PrintScaleMode=1; cpr-ItemNumber: 025619; cpr-ItemName1: TurtleBot4 UI board; cpr-ItemName2: Rev 2; cpr-Revision: 2; cpr-SheetNumber: 5; cpr-SheetTotal: 9; cpr-Draft: AG; cpr-DraftDate: 19/04/2022; Time: DO NOT FILL THIS IN; ImagePath: DO NOT FILL THIS IN; Application_BuildNumber: DO NOT FILL THIS IN
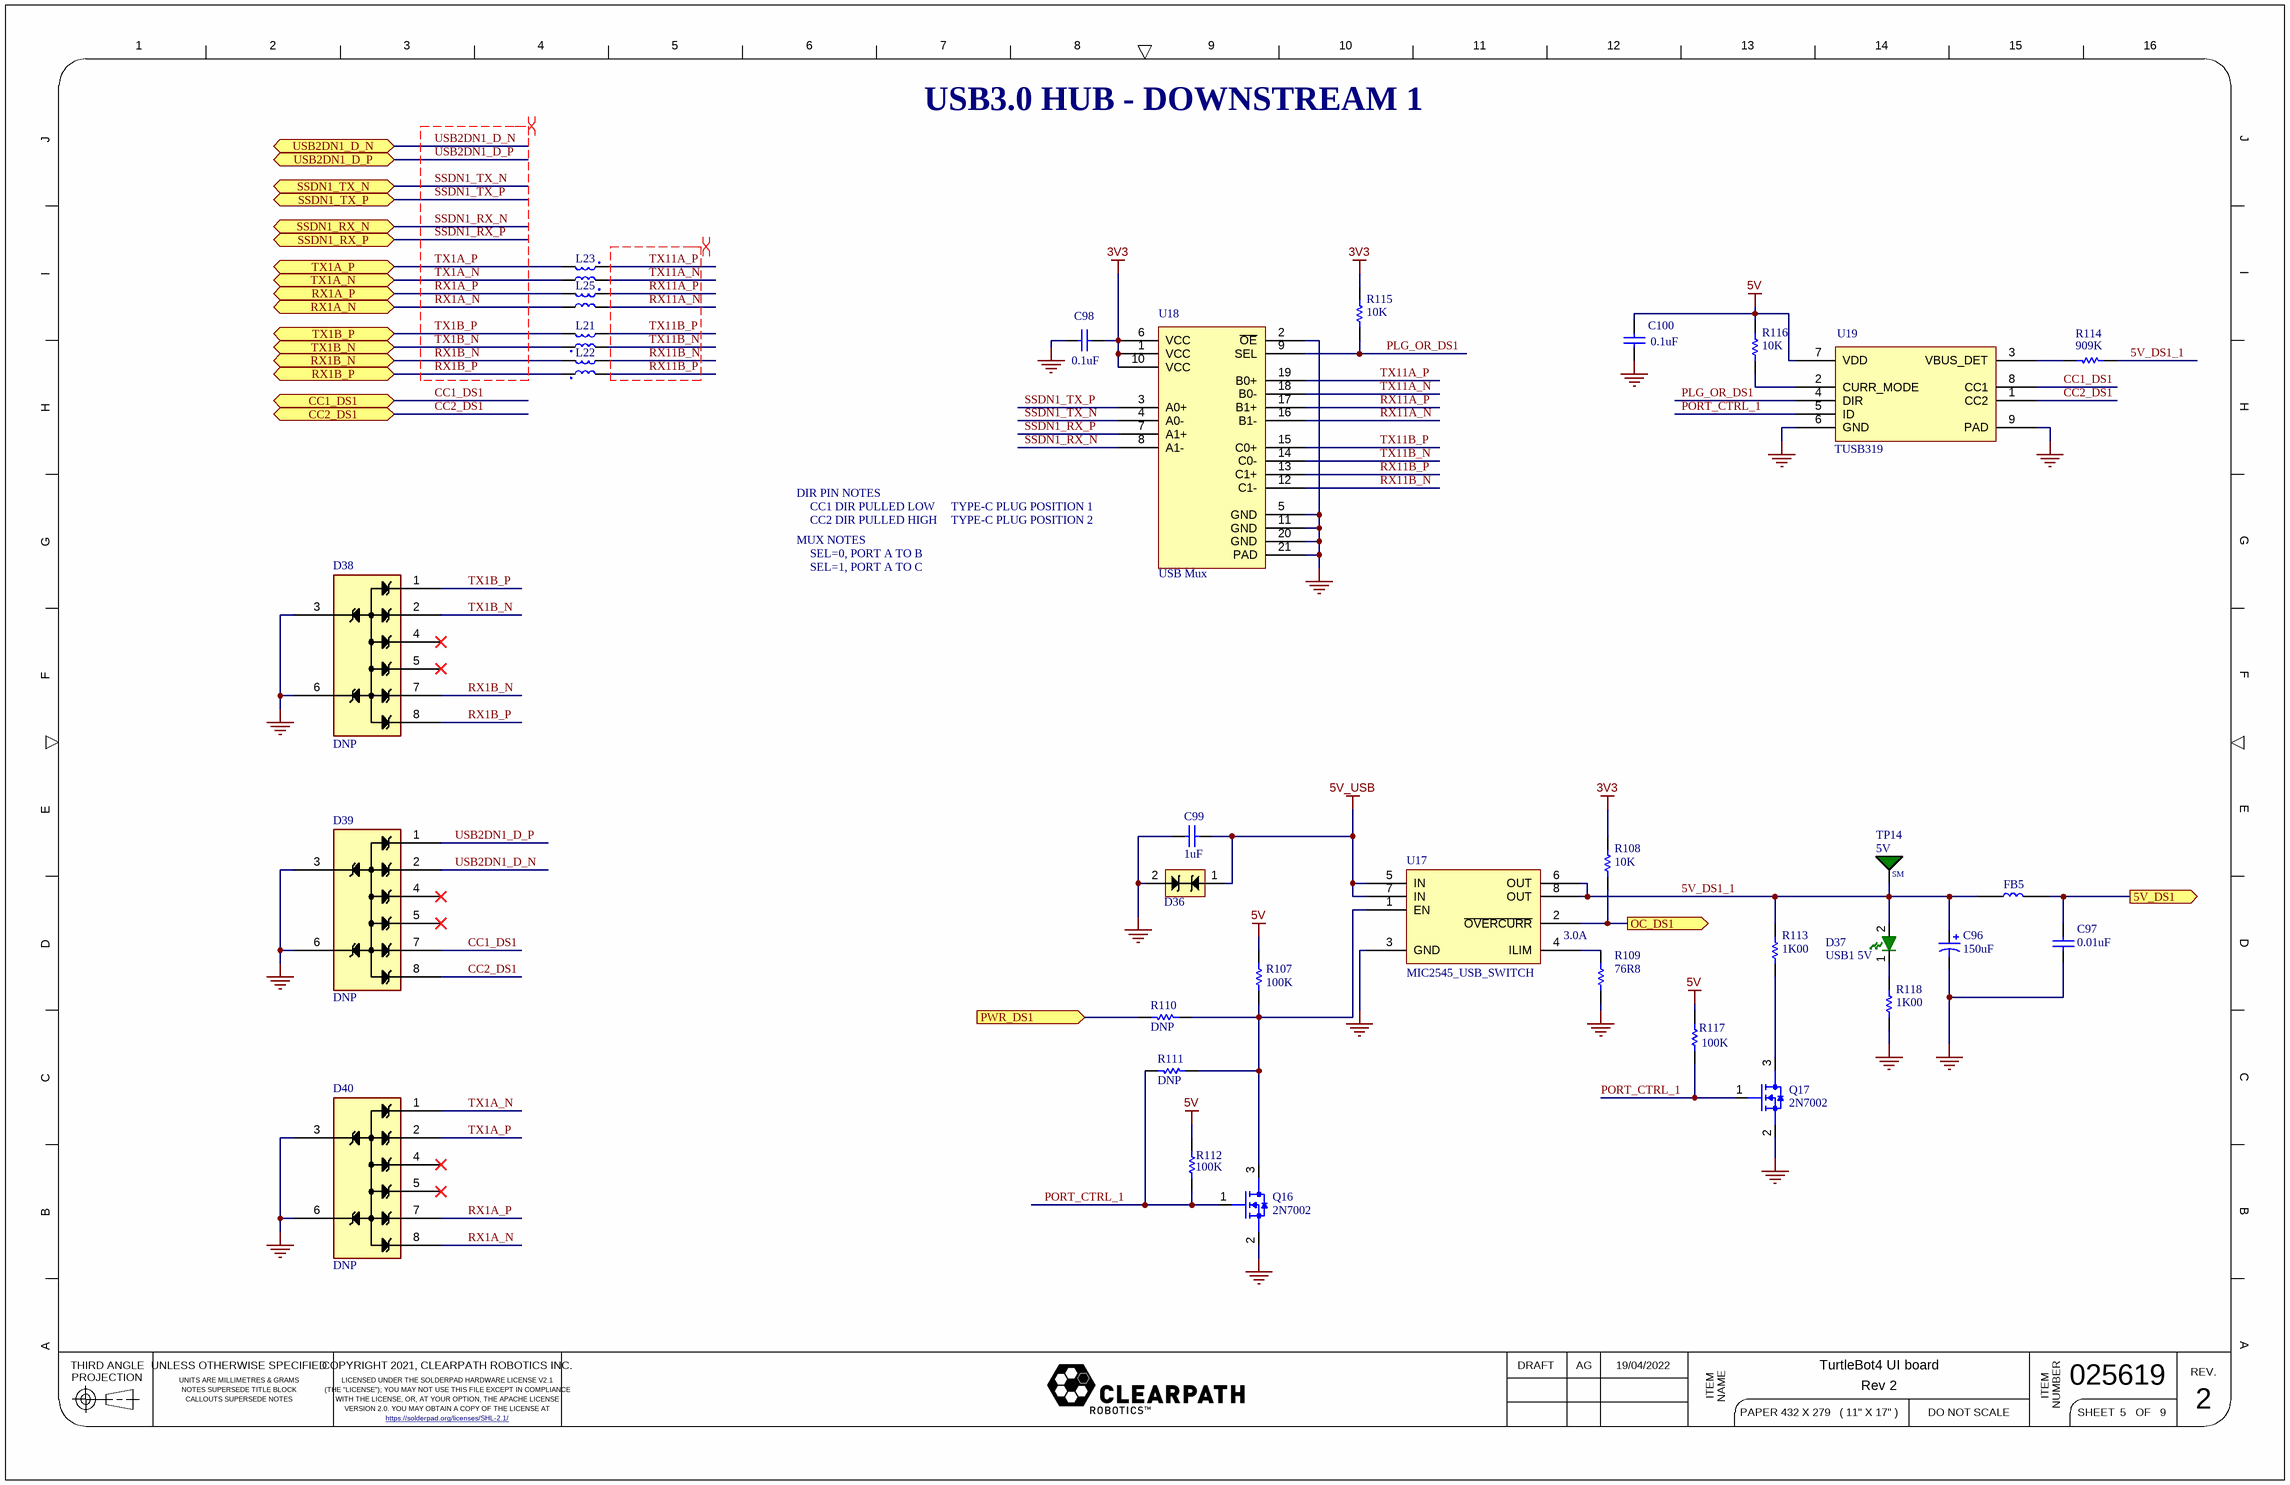
[diagram p7: USB Downstream Type C Port 1.SchDoc]

### Parts
C96  value 150uF  [CAPMP7.6X4.3_3.1N_KEM-M]  (hidden comment: Cap Tant)
C97  value 0.01uF  [C0805]  (hidden comment: Capacitor _SMT)
C98  value 0.1uF  [C0805]  (hidden comment: Capacitor _SMT)
C99  value 1uF  [C0805]  (hidden comment: Capacitor _SMT)
C100  value 0.1uF  [C0805]  (hidden comment: Capacitor _SMT)
D36  TVS DIODE BIDIR 15V SMC  [DO-214AA]  (value not drawn)
D37  USB1 5V  [LED_0805_GRN]
D38  DNP  [ESD7016]
D39  DNP  [ESD7016]
D40  DNP  [ESD7016]
FB5  742792602  [R0603]  (value not drawn)
L21  CMC 100MA 2LN 90 OHM SMD2  [cmc_90_ohms]  (value not drawn)
L22  CMC 100MA 2LN 90 OHM SMD2  [cmc_90_ohms]  (value not drawn)
L23  CMC 100MA 2LN 90 OHM SMD2  [cmc_90_ohms]  (value not drawn)
L25  CMC 100MA 2LN 90 OHM SMD2  [cmc_90_ohms]  (value not drawn)
Q16  Mfg PN: 2N7002  [SOT-23-3]  (hidden comment: NFET)
Q17  Mfg PN: 2N7002  [SOT-23-3]  (hidden comment: NFET)
R107  value 100K  [R0805]  (hidden comment: Resistor_SMT)
R108  value 10K  [R0805]  (hidden comment: Resistor_SMT)
R109  3.0A  value 76R8  [R0805]
R110  value DNP  [R0805]  (hidden comment: Resistor_SMT)
R111  value DNP  [R0805]  (hidden comment: Resistor_SMT)
R112  value 100K  [R0805]  (hidden comment: Resistor_SMT)
R113  value 1K00  [R0805]  (hidden comment: Resistor_SMT)
R114  value 909K  [R0805]  (hidden comment: Resistor_SMT)
R115  value 10K  [R0805]  (hidden comment: Resistor_SMT)
R116  value 10K  [R0805]  (hidden comment: Resistor_SMT)
R117  value 100K  [R0805]  (hidden comment: Resistor_SMT)
R118  value 1K00  [R0805]  (hidden comment: Resistor_SMT)
TP14  5V  [TP_28SM]
U17  MIC2545_USB_SWITCH  [SOIC-8-150]
U18  USB Mux  [TQFN20]
U19  TUSB319  [WSON8]

### Ports
5V_DS1 (out), CC1_DS1 (bidir), CC2_DS1 (bidir), OC_DS1 (out), PWR_DS1 (in), RX1A_N (bidir), RX1A_P (bidir), RX1B_N (bidir), RX1B_P (bidir), SSDN1_RX_N (bidir), SSDN1_RX_P (bidir), SSDN1_TX_N (bidir), SSDN1_TX_P (bidir), TX1A_N (bidir), TX1A_P (bidir), TX1B_N (bidir), TX1B_P (bidir), USB2DN1_D_N (bidir), USB2DN1_D_P (bidir)

### Nets
3V3: C98.1 R108.1 R115.1 U18.1(VCC) U18.6(VCC) U18.10(VCC)
5V: C100.1 R107.2 R112.2 R116.1 R117.2 U19.7(VDD)
5V_USB: C99.2 D36.1 U17.5(IN) U17.7(IN)
GND: C96.2 C97.2 C98.2 C99.1 C100.2 D36.2 D38.3 D38.6 D39.3 D39.6 D40.3 D40.6 Q16.2(D1) Q17.2(D1) R109.1 R118.2 U17.3(GND) U18.2(~{OE}) U18.5(GND) U18.11(GND) U18.20(GND) U18.21(PAD) U19.6(GND) U19.9(PAD)
5V_DS1: C97.1 FB5.2 ; port 5V_DS1
5V_DS1_1: C96.1 D37.2(RA) FB5.1 R113.1 R114.2 TP14.1 U17.6(OUT) U17.8(OUT)
CC1_DS1: D39.7 U19.8(CC1) ; port CC1_DS1
CC2_DS1: D39.8 U19.1(CC2) ; port CC2_DS1
OC_DS1: R108.2 U17.2(~{OVERCURR}) ; port OC_DS1
PLG_OR_DS1: R115.2 U18.9(SEL) U19.4(DIR)
PORT_CTRL_1: Q16.1(G1) Q17.1(G1) R111.1 R112.1 R117.1 U19.5(ID)
PWR_DS1: R110.1 ; port PWR_DS1
RX1A_N: D40.8 L25.3 ; port RX1A_N
RX1A_P: D40.7 L25.4 ; port RX1A_P
RX1B_N: D38.7 L22.2 ; port RX1B_N
RX1B_P: D38.8 L22.1 ; port RX1B_P
RX11A_N: L25.2 U18.16(B1-)
RX11A_P: L25.1 U18.17(B1+)
RX11B_N: L22.3 U18.12(C1-)
RX11B_P: L22.4 U18.13(C1+)
SSDN1_RX_N: U18.8(A1-) ; port SSDN1_RX_N
SSDN1_RX_P: U18.7(A1+) ; port SSDN1_RX_P
SSDN1_TX_N: U18.4(A0-) ; port SSDN1_TX_N
SSDN1_TX_P: U18.3(A0+) ; port SSDN1_TX_P
TX1A_N: D40.1 L23.3 ; port TX1A_N
TX1A_P: D40.2 L23.4 ; port TX1A_P
TX1B_N: D38.2 L21.1 ; port TX1B_N
TX1B_P: D38.1 L21.2 ; port TX1B_P
TX11A_N: L23.2 U18.18(B0-)
TX11A_P: L23.1 U18.19(B0+)
TX11B_N: L21.4 U18.14(C0-)
TX11B_P: L21.3 U18.15(C0+)
USB2DN1_D_N: D39.2 ; port USB2DN1_D_N
USB2DN1_D_P: D39.1 ; port USB2DN1_D_P
NetD37_1: D37.1(RK) R118.1
NetQ16_3: Q16.3(S1) R107.1 R110.2 R111.2 U17.1(EN)
NetQ17_3: Q17.3(S1) R113.2
NetR109_2: R109.2 U17.4(ILIM)
NetR114_1: R114.1 U19.3(VBUS_DET)
NetR116_2: R116.2 U19.2(CURR_MODE)

Not connected (* = marked no-connect by the designer): D38 4* 5*; D39 4* 5*; D40 4* 5*

### Layout directives
differential pair; net class USB3; differential pair class DIFF90; rule Matched Net Lengths [Tolerance = 15mil]: RX1A_N, RX1A_P, RX1B_N, RX1B_P, RX11A_N, RX11A_P, RX11B_N, RX11B_P, SSDN1_RX_N, SSDN1_RX_P, SSDN1_TX_N, SSDN1_TX_P, TX1A_N, TX1A_P, TX1B_N, TX1B_P, TX11A_N, TX11A_P, TX11B_N, TX11B_P, USB2DN1_D_N, USB2DN1_D_P

### Notes on the sheet
- USB3.0 HUB - DOWNSTREAM 1
- DIR PIN NOTES
- MUX NOTES
- CC1 DIR PULLED LOW
- CC2 DIR PULLED HIGH
- SEL=0, PORT A TO B
- SEL=1, PORT A TO C
- TYPE-C PLUG POSITION 1
- TYPE-C PLUG POSITION 2
- 1
- 2
- 3
- 4
- 5
- 6
- 7
- 8
- 9
- 10
- 11
- 12
- 13
- 14
- 15
- 16
- J
- I
- H
- G
- F
- E
- D
- C
- B
- A
- THIRD ANGLE
- PROJECTION
- UNLESS OTHERWISE SPECIFIED
- COPYRIGHT 2021, CLEARPATH ROBOTICS INC.
- DRAFT
- REV.
- UNITS ARE MILLIMETRES & GRAMS
- NOTES SUPERSEDE TITLE BLOCK
- CALLOUTS SUPERSEDE NOTES
- LICENSED UNDER THE SOLDERPAD HARDWARE LICENSE V2.1
- (THE "LICENSE"); YOU MAY NOT USE THIS FILE EXCEPT IN COMPLIANCE
- WITH THE LICENSE, OR, AT YOUR OPTION, THE APACHE LICENSE
- VERSION 2.0. YOU MAY OBTAIN A COPY OF THE LICENSE AT
- https://solderpad.org/licenses/SHL-2.1/ <https://solderpad.https://solderpad.org/licenses/SHL-2.1/org/licenses/SHL-2.1/>
- ITEM
- NAME
- PAPER 432 X 279   ( 11" X 17" )
- DO NOT SCALE
- NUMBER
- SHEET
- OF
- (in symbol TP_28SM) SM

### Library data of the parts
C96 = Cap Pol1: as C92 on sheet USB Downstream Type C Port 2; Voltage: 16V; Tolerance: 10%; Package: 2917; Supplier 1: Digi-Key; Supplier Part Number 1: 718-1746-1-ND
C97 = Capacitor _SMT: as C93 on sheet USB Downstream Type C Port 2; DNP: *; Package: 0603; Supplier 1: Digi-Key; Supplier Part Number 1: 1276-CL10B103KB8WPNDCT-ND
C98 C100 = Capacitor _SMT: as C84 on sheet USB Downstream Type C Port 2; DNP: *; Package: 0805
C99 = Capacitor _SMT: as C85 on sheet USB Downstream Type C Port 2; DNP: *; Package: 0805
D36 = TVS DIODE BIDIR 15V SMC: as D27 on sheet USB Downstream Type C Port 2; Package: DO214AC; Supplier 1: Digi-Key; Supplier Part Number 1: 18-SMA6J5.0CACT-ND
D37 = GREEN_LED: as D31 on sheet USB Downstream Type C Port 2; Package: 0805
D38-D40 = ESD7016: as D33-D35 on sheet USB Downstream Type C Port 2; Vendor 2 PN: *; Vendor 2: *
FB5 = 742792602: as FB4 on sheet USB Downstream Type C Port 2; Supplier 1: Digi-Key; Supplier Part Number 1: 732-4660-1-ND
L21-L23 L25 = CMC 90_Ohms: as L16 on sheet USB Downstream Type C Port 2; Supplier 1: Digi-Key; Supplier Part Number 1: 490-16595-1-ND
Q16 Q17 = NFET_SNGL: as Q14 on sheet USB Downstream Type C Port 2; Package: SOT23-3
R107 R112 R117 = Resistor_SMT: as R90 on sheet USB Downstream Type C Port 2; Power Rating: *; Package: 0805
R108 R115 R116 = Resistor_SMT: as R91 on sheet USB Downstream Type C Port 2; Power Rating: *; Package: 0805
  R108: Supplier 1: Digi-Key; Supplier Part Number 1: 311-10.0KCRTR-ND
R109 = Resistor_SMT: as R100 on sheet USB Downstream Type C Port 2; Power Rating: *; Package: 0805
R110 R111 = Resistor_SMT: as R95 on sheet USB Downstream Type C Port 2; Power Rating: *; Package: 0805
R113 R118 = Resistor_SMT: as R97 on sheet USB Downstream Type C Port 2; Power Rating: *; Package: 0805
R114 = Resistor_SMT: as R103 on sheet USB Downstream Type C Port 2; Power Rating: *; Package: 0805
TP14 = TP_28SM: as TP12 on sheet USB Downstream Type C Port 2; PCB Component: TP_28SM; Status: Draft; Vendor: Clearpath Robotics Inc.; Vendor PN: TP_28SM; Type: SM Pad; Features: Exposed 28mil pad; Octopart Link: N/A
U17 = MIC2545_USB_SWITCH: as U14 on sheet USB Downstream Type C Port 2; Package: SOIC8
U18 = TC7PCI3212: as U16 on sheet USB Downstream Type C Port 2; Package: TQFN-20; Mfg PN: TC7PCI3212MT,LF
U19 = TUSB319: as U15 on sheet USB Downstream Type C Port 2; Package: WSON8